# Altium schematic sheet MPregulator.SchDoc
size A4; SheetNumber: 3; SheetTotal: 10
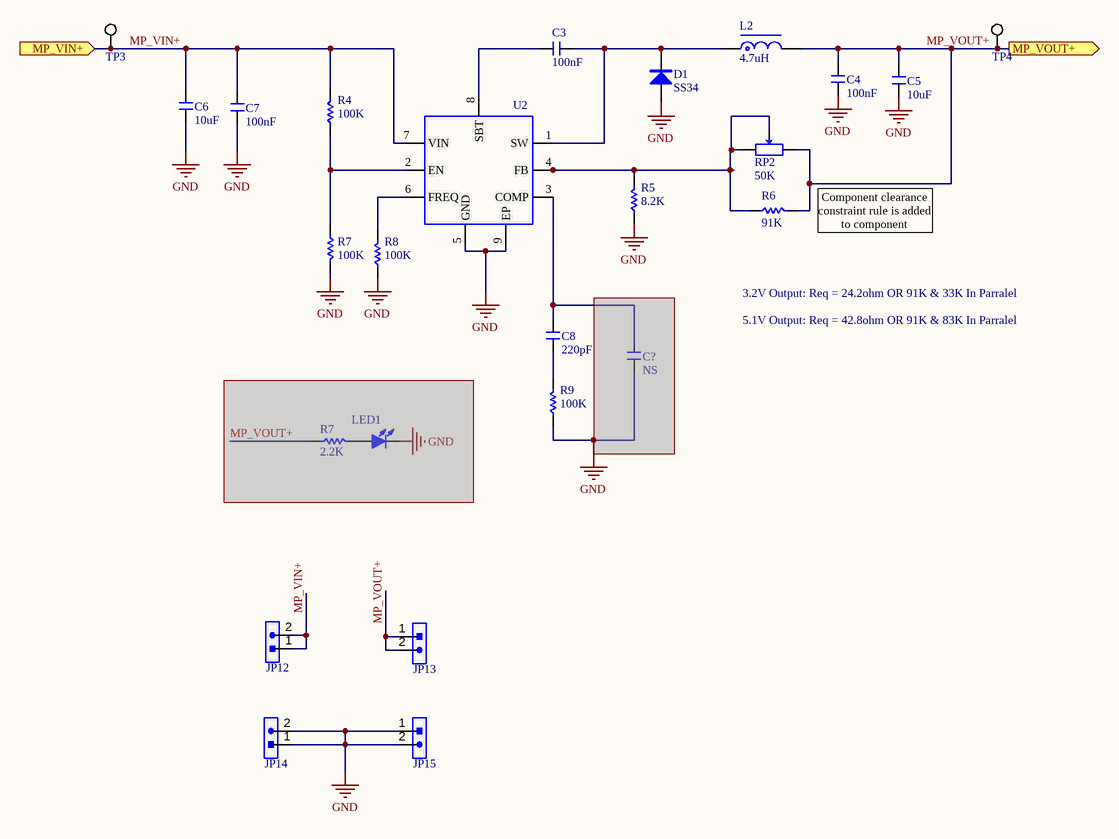
[diagram p0: MPregulator.SchDoc]

## Parts
(Parts that share a designator on the sheet are numbered #1, #2 ... from top to bottom, then left to right.)
C3  100nF  [C 0805]
C4  100nF  [C 0805]
C5  10uF  [C 1206]
C6  10uF  [C 1206]
C7  100nF  [C 0805]
C8  220pF  [C 0805]
C?  NS  [C 0805]  (masked out: inside a compile mask, not in the netlist)
D1  SS34  [SMA]
JP12  HDR-1X2  [HDR-1X2]  (value not drawn)
JP13  HDR-1X2  [HDR-1X2]  (value not drawn)
JP14  HDR-1X2  [HDR-1X2]  (value not drawn)
JP15  HDR-1X2  [HDR-1X2]  (value not drawn)
L2  4.7uH  [WHC0630]
LED1  Power  [LED 0805R]  (value not drawn)  (masked out: inside a compile mask, not in the netlist)
R4  100K  [R 0805]
R5  8.2K  [R 0805]
R6  91K  [R 0805]
R7#1  100K  [R 0805]
R7#2  2.2K  [R 0805]  (masked out: inside a compile mask, not in the netlist)
R8  100K  [R 0805]
R9  100K  [R 0805]
RP2  50K  [3303W]
TP3  Test Point Pad  [TP15]  (value not drawn)
TP4  Test Point Pad  [TP15]  (value not drawn)
U2  (no value)  [SOP8_N-EP]

## Ports
MP_VIN+ (in), MP_VOUT+ (out)

## Nets
GND: C4.1 C5.1 C6.2 C7.1 D1.1(A) JP14.1 JP14.2 JP15.1 JP15.2 R5.1 R7#1.2 R8.1 U2.5(GND) U2.9(EP)
MP_VIN+: C6.1 C7.2 JP12.1 JP12.2 R4.2 TP3.1 U2.7(VIN) ; port MP_VIN+
MP_VOUT+: C4.2 C5.2 JP13.1 JP13.2 L2.2 R6.2 RP2.2 TP4.1 ; port MP_VOUT+
NetC3_1: C3.1 U2.8(SBT)
NetC3_2: C3.2 D1.2(K) L2.1 U2.1(SW)
NetC8_1: C8.1 U2.3(COMP)
NetC8_2: C8.2 R9.2
NetR4_1: R4.1 R7#1.1 U2.2(EN)
NetR5_2: R5.2 R6.1 RP2.1 RP2.ADJ U2.4(FB)
NetR8_2: R8.2 U2.6(FREQ)

Not connected (* = marked no-connect by the designer): R9 1

## Notes on the sheet
- Component clearance constraint rule is added to component parameters
- 5.1V Output: Req = 42.8ohm OR 91K & 83K In Parralel
- 3.2V Output: Req = 24.2ohm OR 91K & 33K In Parralel

## Library data of the parts
C3-C8 C? = C: Non-polar patch capacitor; BOM名称: 无极性贴片电容; 版权归属: 源创客; 学习资源: www.ooocke.com
D1 = SS34: Schottky diodes; BOM名称: 肖特基二极管; 版权归属: 源创客; 属性: 40V/3A; 学习资源: www.ooocke.com
JP12-JP15 = Header 2: 2P Connector; BOM名称: 2P接插件; 版权归属: 源创客; 学习资源: www.ooocke.com
L2 = L-WHC: One-piece high current inductor
LED1 = LED-SMD: RED LED; BOM名称: 贴片LED; 版权归属: 源创客; 学习资源: www.ooocke.com
R4 R5 R7#1 R7#2 R8 R9 = R: Chip resistor; 版权归属: 源创客; BOM名称: Chip resistor; 学习资源: www.ooocke.com
R6 = R: Chip resistor; 版权归属: 源创客; Rule: UNIONINDEX=0|RULEKIND=ComponentClearance|NETSCOPE=AnyNet|LAYERKIND=SameLayer|NAME=Schematic Component Clearance Constraint|GAP=0mil|COLLISIONCHECKMODE=3|VERTICALGAP=0mil|SHOWDISTANCES=FALSE|UNIT=Imperial; BOM名称: Chip resistor; 学习资源: www.ooocke.com
RP2 = RP-SMD: Chip potentiometer; BOM名称: 贴片电位器; 版权归属: 源创客; Rule: UNIONINDEX=0|RULEKIND=ComponentClearance|NETSCOPE=AnyNet|LAYERKIND=SameLayer|NAME=Schematic Component Clearance Constraint|GAP=0mil|COLLISIONCHECKMODE=3|VERTICALGAP=0mil|SHOWDISTANCES=FALSE|UNIT=Imperial; 学习资源: www.ooocke.com
TP3 TP4 = Test Point Pad: Company: SJ Libraries; Designer: Eng. Saeid Jorablo; Rule: UNIONINDEX=0|RULEKIND=ComponentClearance|NETSCOPE=AnyNet|LAYERKIND=SameLayer|NAME=Schematic Component Clearance Constraint|GAP=0mil|COLLISIONCHECKMODE=3|VERTICALGAP=0mil|SHOWDISTANCES=FALSE|UNIT=Imperial; Mounting Technology: Surface Mount\Through-Hole; ComponentLink1Description: Datasheet; Pin Count: 0; Update Date: 6/3/2012; Category: MISC; HelpURL: http://s3.picofile.com/file/7443264187/Coming_Soon_logo.gif
U2 = MP1584: DC step-down chip